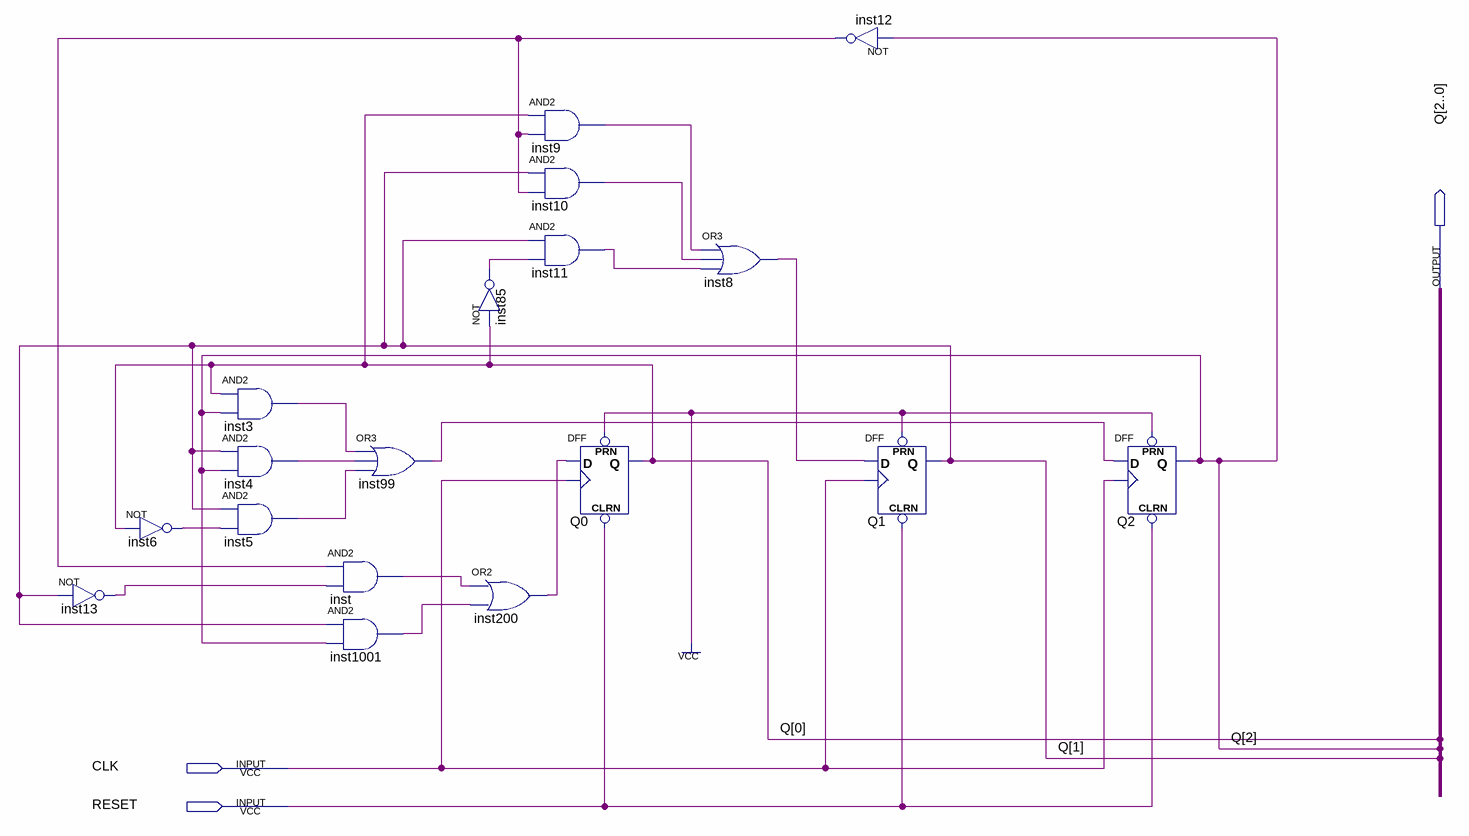
[diagram p0: schematic sheet]
// Quartus schematic GrayCode.bdf as structural Verilog: 18 symbols, 3 pins
module GrayCode (
  input  CLK,
  input  RESET,
  output [2:0] Q
);

  wire inst3_out, inst4_out, inst5_out, inst6_out, inst8_out, inst9_out, inst10_out, inst11_out, inst12_out,
       inst13_out, inst85_out, inst99_out, inst200_out, inst1001_out, inst_out;

  not inst13 (inst13_out, Q[1]);
  not inst6 (inst6_out, Q[0]);
  and inst3 (inst3_out, Q[0], Q[2]);
  and inst4 (inst4_out, Q[1], Q[2]);
  and inst5 (inst5_out, Q[1], inst6_out);
  and inst (inst_out, inst12_out, inst13_out);
  and inst1001 (inst1001_out, Q[1], Q[2]);
  or inst99 (inst99_out, inst3_out, inst4_out, inst5_out);
  not inst85 (inst85_out, Q[0]);
  or inst200 (inst200_out, inst_out, inst1001_out);
  and inst9 (inst9_out, Q[0], inst12_out);
  and inst10 (inst10_out, Q[1], inst12_out);
  and inst11 (inst11_out, Q[1], inst85_out);
  DFF Q0 (.CLRN(RESET), .CLK(CLK), .D(inst200_out), .PRN(1'b1), .Q(Q[0]));
  or inst8 (inst8_out, inst9_out, inst10_out, inst11_out);
  not inst12 (inst12_out, Q[2]);
  DFF Q1 (.CLRN(RESET), .CLK(CLK), .D(inst8_out), .PRN(1'b1), .Q(Q[1]));
  DFF Q2 (.CLRN(RESET), .CLK(CLK), .D(inst99_out), .PRN(1'b1), .Q(Q[2]));
endmodule
